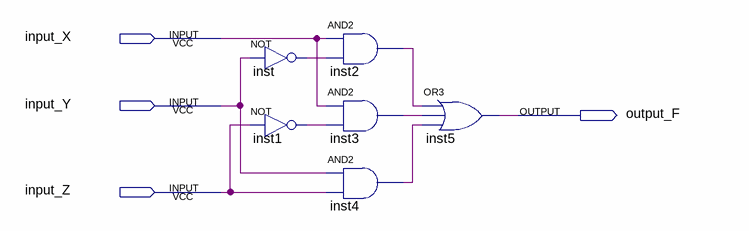
[diagram p0: schematic sheet]
// Quartus schematic TaskTwoVarSix.bdf as structural Verilog: 6 symbols, 4 pins
module TaskTwoVarSix (
  input  input_X,
  input  input_Y,
  input  input_Z,
  output output_F
);

  wire inst1_out, inst2_out, inst3_out, inst4_out, inst_out;

  not inst (inst_out, input_Y);
  not inst1 (inst1_out, input_Z);
  and inst2 (inst2_out, input_X, inst_out);
  and inst3 (inst3_out, input_X, inst1_out);
  and inst4 (inst4_out, input_Y, input_Z);
  or inst5 (output_F, inst2_out, inst3_out, inst4_out);
endmodule
